# Altium project MSXIV_DC-DC_Converter.PrjPcb
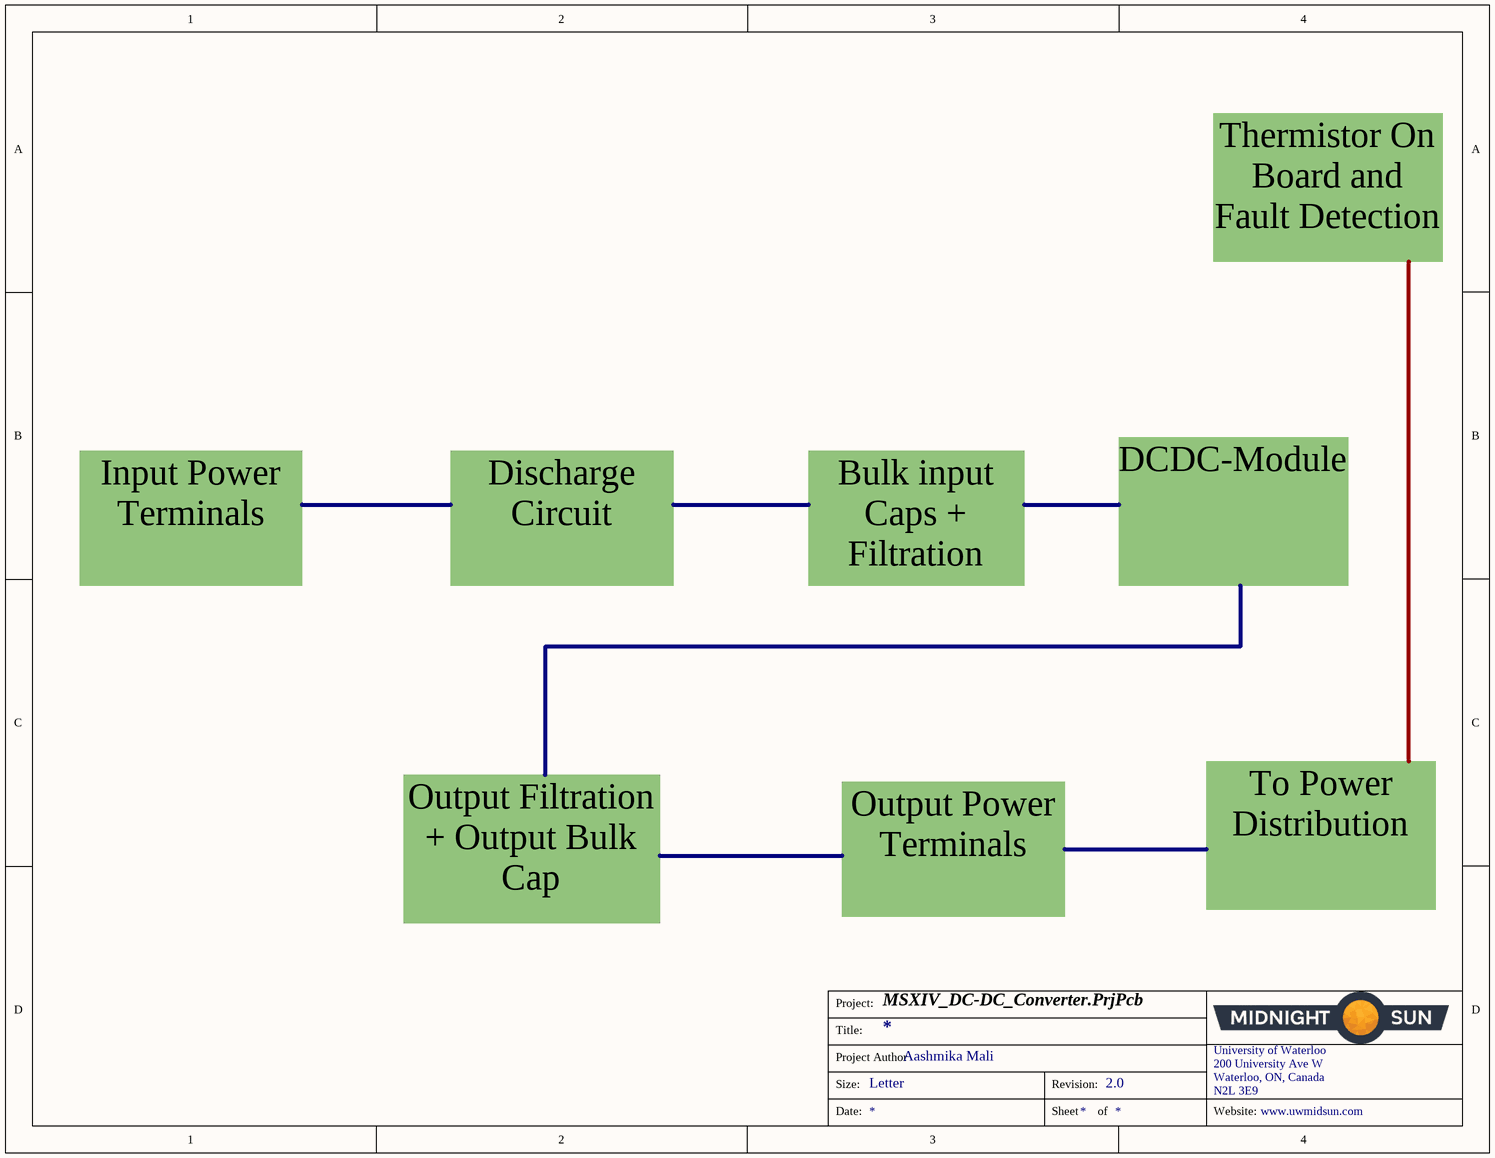
[diagram p0: Block_Diagram.SchDoc]
ProjectAuthor: Aashmika Mali; ProjectRevision: 2.0
3 sheets, 69 parts. Net scope: flat (ports and power ports of the same name join across sheets).
Board file: MSXIV_DC-DC_Converter.PcbDoc
Sheets:
  Block_Diagram.SchDoc
  MSXIV_DC-DC_Converter.SchDoc
  MSXIV_Discharge_Circuit.SchDoc

## Sheet Block_Diagram.SchDoc
size Letter; Website: www.uwmidsun.com

### Notes on the sheet
- Thermistor On Board and Fault Detection
- Input Power Terminals
- Discharge Circuit
- Bulk input Caps + Filtration
- DCDC-Module
- Output Power Terminals
- To Power Distribution
- Output Filtration + Output Bulk Cap
- Project:
- Title:
- Size:
- Project Author
- Letter
- Revision:
- University of Waterloo
- 200 University Ave W
- Waterloo, ON, Canada
- N2L 3E9
- Date:
- Sheet
- of
- Website:

## Sheet MSXIV_DC-DC_Converter.SchDoc
size B
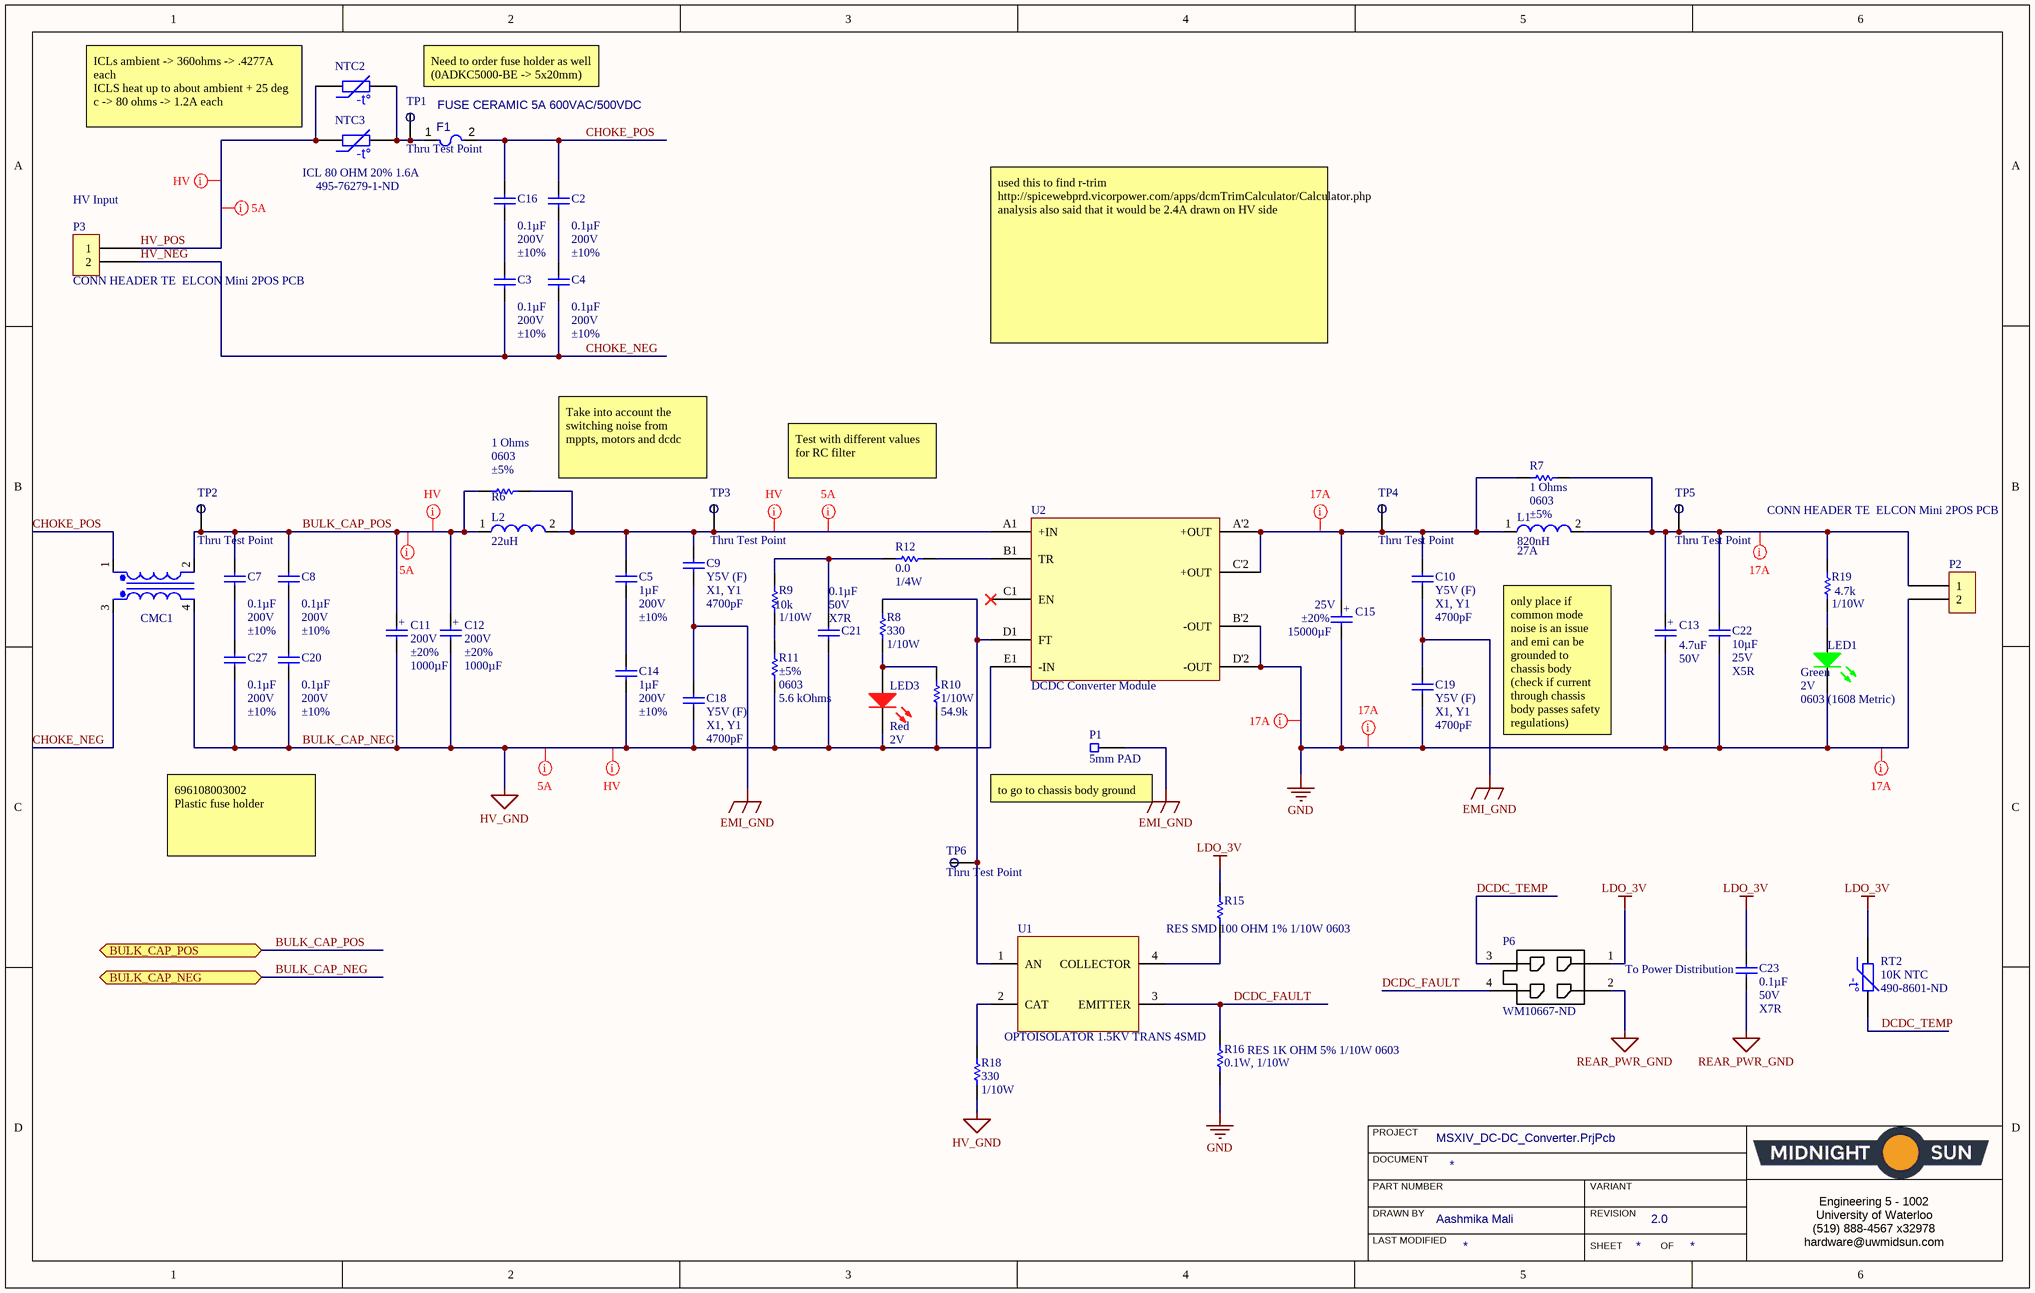
[diagram p1: MSXIV_DC-DC_Converter.SchDoc]

### Parts
C2  Capacitance: 0.1µF  Voltage - Rated: 200V  Tolerance: ±10%  [CAP, 1206]  (hidden comment: CAP CER 0.1UF 200V X7R 1206)
C3  Capacitance: 0.1µF  Voltage - Rated: 200V  Tolerance: ±10%  [CAP, 1206]  (hidden comment: CAP CER 0.1UF 200V X7R 1206)
C4  Capacitance: 0.1µF  Voltage - Rated: 200V  Tolerance: ±10%  [CAP, 1206]  (hidden comment: CAP CER 0.1UF 200V X7R 1206)
C5  Capacitance: 1µF  Voltage - Rated: 200V  Tolerance: ±10%  [CAP, 2220]  (hidden comment: CAP CER 1UF 200V X7R 2220)
C7  Capacitance: 0.1µF  Voltage - Rated: 200V  Tolerance: ±10%  [CAP, 1206]  (hidden comment: CAP CER 0.1UF 200V X7R 1206)
C8  Capacitance: 0.1µF  Voltage - Rated: 200V  Tolerance: ±10%  [CAP, 1206]  (hidden comment: CAP CER 0.1UF 200V X7R 1206)
C9  value 4700pF  Temperature Coefficient: Y5V (F)  Ratings: X1, Y1  [CAP 4700PF 400VAC Y5V RADIAL]  (hidden comment: CAP CER 4700PF 400VAC Y5V RADIAL)
C10  value 4700pF  Temperature Coefficient: Y5V (F)  Ratings: X1, Y1  [CAP 4700PF 400VAC Y5V RADIAL]  (hidden comment: CAP CER 4700PF 400VAC Y5V RADIAL)
C11  Voltage - Rated: 200V  Tolerance: ±20%  Capacitance: 1000µF  [CAP ALUM 1000uF 200V]  (hidden comment: CAP ALUM 1000UF 20% 200V SNAP)
C12  Voltage - Rated: 200V  Tolerance: ±20%  Capacitance: 1000µF  [CAP ALUM 1000uF 200V]  (hidden comment: CAP ALUM 1000UF 20% 200V SNAP)
C13  Capacitance: 4.7uF  Voltage Rating (DC): 50V  [CAP ALUM 6.3MM RADIAL SMD]  (hidden comment: EEE-1HA4R7NP)
C14  Capacitance: 1µF  Voltage - Rated: 200V  Tolerance: ±10%  [CAP, 2220]  (hidden comment: CAP CER 1UF 200V X7R 2220)
C15  Voltage - Rated: 25V  Tolerance: ±20%  Capacitance: 15000µF  [CAP ALUM 1000uF 200V]  (hidden comment: CAP ALUM 15000UF 20% 25V SNAP)
C16  Capacitance: 0.1µF  Voltage - Rated: 200V  Tolerance: ±10%  [CAP, 1206]  (hidden comment: CAP CER 0.1UF 200V X7R 1206)
C18  value 4700pF  Temperature Coefficient: Y5V (F)  Ratings: X1, Y1  [CAP 4700PF 400VAC Y5V RADIAL]  (hidden comment: CAP CER 4700PF 400VAC Y5V RADIAL)
C19  value 4700pF  Temperature Coefficient: Y5V (F)  Ratings: X1, Y1  [CAP 4700PF 400VAC Y5V RADIAL]  (hidden comment: CAP CER 4700PF 400VAC Y5V RADIAL)
C20  Capacitance: 0.1µF  Voltage - Rated: 200V  Tolerance: ±10%  [CAP, 1206]  (hidden comment: CAP CER 0.1UF 200V X7R 1206)
C21  Capacitance: 0.1µF  Voltage: 50V  Temperature Coefficient: X7R  [CAP, 0603]  (hidden comment: CAP CER 0.1UF 50V 10% X7R 0603)
C22  Capacitance: 10µF  Voltage: 25V  Temperature Coefficient: X5R  [CAP, 0603]  (hidden comment: CAP CER 10uF 25V 20% X5R 0603)
C23  Capacitance: 0.1µF  Voltage: 50V  Temperature Coefficient: X7R  [CAP, 0603]  (hidden comment: CAP CER 0.1UF 50V 10% X7R 0603)
C27  Capacitance: 0.1µF  Voltage - Rated: 200V  Tolerance: ±10%  [CAP, 1206]  (hidden comment: CAP CER 0.1UF 200V X7R 1206)
CMC1  CM Choke  [LCCI 50 Common mode choke]  (value not drawn)
F1  FUSE CERAMIC 5A 600VAC/500VDC  [0ADKC5000-BE-Footprint-1]
L1  Inductance: 820nH  Current Rating: 27A  [WE-HCI-1365]  (hidden comment: FIXED IND 820NH 27A 0.9 MOHM SMD)
L2  Inductance: 22uH  [WE-PD-XXL]  (hidden comment: FIXED IND 22UH 5.3A 28 MOHM SMD)
LED1  Package / Case: 0603 (1608 Metric)  Color: Green  Voltage - Forward (Vf) (Typ): 2V  [LED_0603]  (hidden comment: LED GREEN CLEAR 2V 0603)
LED3  Color: Red  Voltage - Forward (Vf) (Typ): 2V  [LED_0603]  (hidden comment: LED RED CLEAR 2V 0603)
NTC2  ICL 80 OHM 20% 1.6A  [ICL_THROUGH_HOLE_B57236S0800M051]  (value not drawn)
NTC3  ICL 80 OHM 20% 1.6A  Supplier Part Number 1: 495-76279-1-ND  [ICL_THROUGH_HOLE_B57236S0800M051]
P1  5mm PAD  [5mm PAD]
P2  CONN HEADER TE  ELCON Mini 2POS PCB  [CONN HEADER TE  ELCON Mini 2POS PCB-Footprint-1]
P3  CONN HEADER TE  ELCON Mini 2POS PCB  [CONN HEADER TE  ELCON Mini 2POS PCB-Footprint-1]
P6  Supplier Part Number 1: WM10667-ND  [CONN 4POS MICROFIT (2x2)]  (hidden comment: CONN 4POS MICRO-FIT 3mm)
R6  Resistance: 1 Ohms  Supplier Device Package: 0603  Tolerance: ±5%  [RES, 0603]  (hidden comment: RES 1 OHM 5% 1/10W 0603)
R7  Resistance: 1 Ohms  Supplier Device Package: 0603  Tolerance: ±5%  [RES, 0603]  (hidden comment: RES 1 OHM 5% 1/10W 0603)
R8  Resistance: 330  Power: 1/10W  [RES, 0603]  (hidden comment: RES 330 OHM 1% 1/10W 0603)
R9  Resistance: 10k  Power: 1/10W  [RES, 0603]  (hidden comment: RES 10K OHM 1% 1/10W 0603)
R10  Power (Watts): 1/10W  Resistance (Ohms): 54.9k  [RES, 0603]  (hidden comment: RES 54.9K OHM 1% 1/10W 0603)
R11  Tolerance: ±5%  Supplier Device Package: 0603  Resistance: 5.6 kOhms  [RES, 0603]  (hidden comment: RES 15.6K OHM 0.1% 1/10W 0402)
R12  Resistance: 0.0  Power (Watts): 1/4W  [RES, 0603]  (hidden comment: RES 0.0 OHM 1/4W 0603)
R15  RES SMD 100 OHM 1% 1/10W 0603  [RESC1608X55X25NL10T15]
R16  RES 1K OHM 5% 1/10W 0603  Power (Watts): 0.1W, 1/10W  [RES, 0603]
R18  Resistance: 330  Power: 1/10W  [RES, 0603]  (hidden comment: RES 330 OHM 1% 1/10W 0603)
R19  Resistance (Ohms): 4.7k  Power (Watts): 1/10W  [RES, 0603]  (hidden comment: RES 4.7K OHM 1% 1/10W 0603)
RT2  10K NTC  Supplier Part Number 1: 490-8601-ND  [NTC THERMISTOR BEAD]
TP1  Thru Test Point  [Thru Test Point]
TP2  Thru Test Point  [Thru Test Point]
TP3  Thru Test Point  [Thru Test Point]
TP4  Thru Test Point  [Thru Test Point]
TP5  Thru Test Point  [Thru Test Point]
TP6  Thru Test Point  [Thru Test Point]
U1  OPTOISOLATOR 1.5KV TRANS 4SMD  [SOIC127P610X228-4N]
U2  Type: DCDC Converter Module  [IC, DCDC converter DCM3623TA5N17B4T70]  (hidden comment: DCDC VICOR CONVERTER 15V 240W - DCM3623TA5N17B4T70)

### Ports
BULK_CAP_NEG (bidir), BULK_CAP_POS (bidir)

### Nets
BULK_CAP_NEG: C11.2 C12.2 C14.2 C18.2 C20.2 C21.2 C27.2 CMC1.4 LED3.2(K) R10.2 R11.1 R18.2 U2.E1(-IN) ; port BULK_CAP_NEG  [also labelled HV_GND]
EMI_GND: C9.2 C10.2 C18.1 C19.1 P1.1
GND: C13.2 C15.2 C19.2 C22.2 LED1.2(K) P2.2 R16.2 U2.B'2(-OUT) U2.D'2(-OUT)
LDO_3V: C23.1 P6.1 R15.2 RT2.1
REAR_PWR_GND: C23.2 P6.2
BULK_CAP_POS: C7.1 C8.1 C11.1 C12.1 CMC1.2 L2.1 R6.1 TP2.TH_TP ; port BULK_CAP_POS
CHOKE_NEG: C3.2 C4.2 CMC1.3 P3.2  [also labelled HV_NEG]
CHOKE_POS: C2.1 C16.1 CMC1.1 F1.2
DCDC_FAULT: P6.4 R16.1 U1.3(EMITTER)
DCDC_TEMP: P6.3 RT2.2
HV_POS: NTC2.1 NTC3.1 P3.1
NetC2_2: C2.2 C4.1
NetC3_1: C3.1 C16.2
NetC5_1: C5.1 C9.1 L2.2 R6.2 TP3.TH_TP U2.A1(+IN)
NetC5_2: C5.2 C14.1
NetC7_2: C7.2 C27.1
NetC8_2: C8.2 C20.1
NetC10_1: C10.1 C15.1 L1.1 R7.1 TP4.TH_TP U2.A'2(+OUT) U2.C'2(+OUT)
NetC13_1: C13.1 C22.1 L1.2 P2.1 R7.2 R19.1 TP5.TH_TP
NetC21_1: C21.1 R9.1 R12.1
NetF1_1: F1.1 NTC2.2 NTC3.2 TP1.TH_TP
NetLED1_1: LED1.1(A) R19.2
NetLED3_1: LED3.1(A) R8.2 R10.1
NetR8_1: R8.1 TP6.TH_TP U1.1(AN) U2.D1(FT)
NetR9_2: R9.2 R11.2
NetR12_2: R12.2 U2.B1(TR)
NetR15_1: R15.1 U1.4(COLLECTOR)
NetR18_1: R18.1 U1.2(CAT)

Not connected (* = marked no-connect by the designer): U2 C1(EN)*

### Layout directives
net class HV: BULK_CAP_NEG, BULK_CAP_POS, HV_POS, NetC5_1
net class 5A: BULK_CAP_NEG, BULK_CAP_POS, HV_POS, NetC5_1
net class 20A: GND, NetC10_1, NetC13_1

### Notes on the sheet
- (near TP1) Need to order fuse holder as well
  (0ADKC5000-BE -> 5x20mm)
- ICLs ambient -> 360ohms -> .4277A each
  ICLS heat up to about ambient + 25 deg c -> 80 ohms -> 1.2A each
- (near P3) HV Input
- used this to find r-trim http://spicewebprd.vicorpower.com/apps/dcmTrimCalculator/Calculator.php
  analysis also said that it would be 2.4A drawn on HV side
- Take into account the switching noise from mppts, motors and dcdc
- Test with different values for RC filter
- only place if common mode noise is an issue and emi can be grounded to chassis body (check if current through chassis body passes safety regulations)
- (near P1) to go to chassis body ground
- 696108003002
  Plastic fuse holder
- (near C23) To Power Distribution
- PROJECT
- DOCUMENT
- DRAWN BY
- LAST MODIFIED
- PART NUMBER
- REVISION
- SHEET
- VARIANT
- OF
- Engineering 5 - 1002
  University of Waterloo
  (519) 888-4567 x32978
  hardware@uwmidsun.com
- (in symbol CAP ALUM 4.7UF 20% 50V SMD) +
- (in symbol CAP ALUM 1000UF 20% 200V SNAP) +
- (in symbol CAP ALUM 15000UF 20% 25V SNAP) +
- (in symbol ICL 80 OHM 20% 1.6A) -t°
- (in symbol NTC THERMISTOR 10K 1% BEAD) -t°

### Library data of the parts
C2-C4 C7 C8 C16 C20 C27 = CAP CER 0.1UF 200V X7R 1206: Manufacturer 1: Manufacturer; Manufacturer Part Number 1: 885342208002; Supplier 1: Digi-Key; Supplier Part Number 1: 732-12081-1-ND; Temperature Coefficient: X7R; Package / Case: 1206 (3216 Metric)
C5 C14 = CAP CER 1UF 200V X7R 2220: 1µF ±10% 200V Ceramic Capacitor X7R 2220 (5750 Metric); Manufacturer: Murata Electronics; Manufacturer Part Number 1: GRM55DR72D105KW01L; Mounting Type 1: Surface Mount, MLCC; Supplier 1: Digi-Key; Supplier Part Number 1: 490-14683-1-ND; Temperature Coefficient: X7R; Package / Case: 2220 (5750 Metric); Size / Dimension: 0.224" L x 0.197" W (5.70mm x 5.00mm)
C9 C10 C18 C19 = CAP CER 4700PF 400VAC Y5V RADIAL: 4700pF ±20% 400VAC Ceramic Capacitor Y5V (F) Radial, Disc; Manufacturer: KEMET; Manufacturer Part Number: C951U472MVVDBA7317; Supplier 1: Digi-Key; RoHS: RoHS Compliant; Category: Capacitors; Stock 1: 9713; Pricing 1: 1=1.12, 10=0.795, 100=0.5234, 500=0.38772 (CAD); Packaging: Cut Tape (CT); Part Status: Active; Tolerance: ±20%; Voltage - Rated: 400VAC; Operating Temperature: -40°C ~ 125°C; Features: -; Applications: Safety; Failure Rate: -; Mounting Type: Through Hole; Package / Case: Radial, Disc; Size / Dimension: 0.472" Dia (12.00mm); Height - Seated (Max): -; Thickness (Max): -; Lead Spacing: 0.394" (10.00mm); Lead Style: Formed Leads - Kinked; ComponentLink1URL: https://search.kemet.com/component-edge/download/datasheet/C951U472MVVDBA7317.pdf; ComponentLink1Description: https://search.kemet.com/component-edge/download/datasheet/C951U472MVVDBA7317.pdf; Supplier Part Number 1: 399-9517-1-ND
C11 C12 = CAP ALUM 1000UF 20% 200V SNAP: CAP RADIAL ALUM 1000UF 20% 200V SNAP; Manufacturer 1: Cornell Dubilier Electronics (CDE); Manufacturer Part Number 1: SLPX102M200C4P3; ESR (Equivalent Series Resistance): 199mOhm @ 120Hz; Polarization: Polar; Supplier 1: Digi-Key; Supplier Part Number 1: 338-1557-ND; Mounting Type: Through Hole; Package / Case: Radial, Can - Snap-In
C13 = CAP ALUM 4.7UF 20% 50V SMD: 4.7µF 50V Aluminum Electrolytic Capacitors Radial, Can - SMD 2000 Hrs @ 85°C; Manufacturer 1: Panasonic; Description 1: CAPACITOR ALUM ELEC, 4.7UF, 50V, 20%, SMD; Ripple Current: 31mA; Tolerance: 20%; Life (Hours): 2000Hour; Supplier 1: Digi-Key; Supplier Part Number 1: PCE4304CT-ND; Manufacturer Part Number 1: EEE-1HA4R7NP; Stock 1: 19771; Pricing 1: 1=0.43, 10=0.302, 100=0.1986, 500=0.1471 (USD); Mount: Surface Mount,PCB; Case/Package: Radial; Min Operating Temperature: -40°C; Max Operating Temperature: 85°C; Voltage Rating: 50V; Ripple Current (AC): 31mA; Packaging: Tape and Reel; Package Quantity: 1; Termination: SMD/SMT; Diameter: 6.3mm; Length: 5.5mm; Height: 5.4mm; Height - Seated (Max): 0.213inch; Width: 650um; Radiation Hardening: No; REACH SVHC: No SVHC; Lead Free: Lead Free; ComponentLink1URL: https://datasheet.ciiva.com/46374/aba0000ce2-46374373.pdf; ComponentLink1Description: https://datasheet.ciiva.com/46374/aba0000ce2-46374373.pdf; ComponentLink2URL: https://datasheet.ciiva.com/14600/70255710-14600343.pdf; ComponentLink2Description: https://datasheet.ciiva.com/14600/70255710-14600343.pdf; ComponentLink3URL: https://datasheet.ciiva.com/17536/aba0000ce2-17536647.pdf; ComponentLink3Description: https://datasheet.ciiva.com/17536/aba0000ce2-17536647.pdf; ComponentLink4URL: https://datasheet.ciiva.com/24027/aba0000ce2-40801-24027083.pdf; ComponentLink4Description: https://datasheet.ciiva.com/24027/aba0000ce2-40801-24027083.pdf; ComponentLink5URL: https://datasheet.ciiva.com/31414/aba0000ce2-31414684.pdf; ComponentLink5Description: https://datasheet.ciiva.com/31414/aba0000ce2-31414684.pdf; ComponentLink6URL: https://datasheet.ciiva.com/14606/70255710-14606079.pdf; ComponentLink6Description: https://datasheet.ciiva.com/14606/70255710-14606079.pdf
C15 = CAP ALUM 15000UF 20% 25V SNAP: 15000µF 25V Aluminum Electrolytic Capacitors Radial, Can - Snap-In 40mOhm 3000 Hrs @ 105°C; Manufacturer: Cornell Dubilier Electronics (CDE); Manufacturer Part Number: SLP153M025C4P3; Parameter 1: 0.984" Dia (25.00mm); Supplier 1: Digi-Key; Supplier Part Number 1: 338-1470-ND; Size / Dimension: 0.984" Dia (25.00mm)
C21 C23 = CAP CER 0.1UF 50V 10% X7R 0603: 0.10µF ±10% 50V Ceramic Capacitor X7R 0603 (1608 Metric); Manufacturer 1: AVX Corporation; Manufacturer Part Number 1: 06035C104KAT2A; Supplier 1: Digi-Key; Supplier Part Number 1: 478-5052-1-ND; Packaging: Cut Tape (CT); Part Status: Active; Operating Temperature: -55°C ~ 125°C; Ratings: -; Mounting Type: Surface Mount, MLCC; Package / Case: 0603 (1608 Metric); Size / Dimension: 0.063" L x 0.032" W (1.60mm x 0.81mm); Height - Seated (Max): -; Thickness (Max): 0.035" (0.90mm); Lead Spacing: -; Lead Style: -; ComponentLink1URL: http://datasheets.avx.com/X7RDielectric.pdf; ComponentLink1Description: http://datasheets.avx.com/X7RDielectric.pdf; Tolerance: ±10%
C22 = CAP CER 10uF 25V 20% X5R 0603: 10µF ±20% 25V Ceramic Capacitor X5R 0603 (1608 Metric); Manufacturer 1: Murata Electronics North America; Manufacturer Part Number 1: GRM188R61E106MA73D; Supplier 1: Digi-Key; Supplier Part Number 1: 490-7202-1-ND; Packaging: Cut Tape (CT); Part Status: Active; Operating Temperature: -55°C ~ 85°C; Ratings: -; Mounting Type: Surface Mount, MLCC; Package / Case: 0603 (1608 Metric); Size / Dimension: 0.063" L x 0.031" W (1.60mm x 0.80mm); Height - Seated (Max): -; Thickness (Max): 0.031" (0.80mm); Lead Spacing: -; Lead Style: -; ComponentLink1URL: http://www.murata.com/~/media/webrenewal/support/library/catalog/products/capacitor/mlcc/c02e.ashx; ComponentLink1Description: http://www.murata.com/~/media/webrenewal/support/library/catalog/products/capacitor/mlcc/c02e.ashx; Tolerance: ±20%
CMC1 = COMMON MODE CHOKE 5.6A 2LN SMD: 2 Line Common Mode Choke Surface Mount  5.6A DCR 21mOhm; PartNumber: P0353NL; Manufacturer 1: Pulse Electronics Power; Manufacturer Part Number 1: P0353NLT; Filter Type: Power Line; Number of Lines: 2; Package: TBD; Supplier 1: Digi-Key; Supplier Part Number 1: 553-1764-1-ND; Current Rating (Max): 5.6A; DC Resistance (DCR) (Max): 21mOhm
F1 = CMP-005-00013-1: FUSE CERAMIC 5A 600VAC/500VDC FOOTPRINT IS FOR 5x20mm HOLDER; Fuse Type: Cartridge, Ceramic; Approvals: cURus; Voltage Rating (DC): 500V; Voltage Rating (AC): 600V; Mount: Holder; Current Rating: 5A; Min Operating Temperature: -55°C; Max Operating Temperature: 125°C; Packaging: Bulk
L1 = CMP-006-00021-1: WURTH ELEKTRONIK         744355182             Surface Mount Power Inductor, WE-HCI Series, 820 nH, 27 A, 35 A, Shielded, 9000 ohm; Test Frequency: 100kHz; Saturation Current: 35A; DC Resistance (DCR): 0.9mR; Inductance Tolerance: 20%; Self Resonant Frequency: 72MHz; Series Resistance: 900mR; Packaging: Tape and Reel; Min Operating Temperature: -40°C; Length: 13.2mm; Composition: Wirewound; RMS Current (Irms): 27A; Width: 12.8mm; Shielding: Shielded; Military Standard: Not; Case/Package: 1365; Termination: SMD/SMT; Max Operating Temperature: 155°C; Number of Pins: 2; REACH SVHC: Unknown; Tolerance: 20%; Height - Seated (Max): 0.197inch; Depth: 13.3mm; Height: 6.2mm; Max DC Current: 27A; Mount: Surface Mount; Package Quantity: 400
L2 = CMP-006-00023-1: Inductor, SMD 22 uH 5.3 A ±20%, 7447709220, Würth Elektronik; Test Frequency: 1kHz; Self Resonant Frequency: 10MHz; Series Resistance: 28mR; Saturation Current: 6.5A; Shielding: Shielded; Core Material: Ferrite; Inductance Tolerance: 20%; Case/Package: Nonstandard; Height: 10mm; DC Current: 5.3A; Military Standard: Not; Number of Pins: 2; Length: 12mm; Composition: Wirewound; Height - Seated (Max): 0.394inch; Case Code (Metric): 3225; Depth: 12.5mm; RMS Current (Irms): 5.3A; REACH SVHC: Unknown; Max Operating Temperature: 125°C; Resistance: 28mR; Termination: SMD/SMT; Weight: 0.01lb; Case Code (Imperial): 1210; Current Rating: 5.3A; Max DC Current: 5.3A; Mount: Surface Mount; Width: 12mm; Package Quantity: 250; DC Resistance (DCR): 28mR; Lead Pitch: 7mm; Min Operating Temperature: -40°C; Tolerance: 20%; Packaging: Tape and Reel
LED1 = LED GREEN CLEAR 2V 0603: Green 572nm LED Indication - Discrete 2V 0603 (1608 Metric); Manufacturer: Wurth Electronics Inc.; Manufacturer Part Number: 150060VS75000; Lens Color: Colorless; Millicandela Rating: 40mcd; Lens Style/Size: Rectangle with Flat Top, 1.10mm x 0.70mm; Current - Test: 20mA; Viewing Angle: 140°; Wavelength - Dominant: 570nm; Supplier 1: Digi-Key; RoHS: RoHS Compliant; Category: Optoelectronics; Stock 1: 9408; Pricing 1: 1=0.21, 100=0.1617, 500=0.13964 (CAD); Packaging: Cut Tape (CT); Part Status: Active; Lens Transparency: Clear; Mounting Type: Surface Mount; Wavelength - Peak: 572nm; Features: -; Supplier Device Package: 0603; Size / Dimension: 1.60mm L x 0.80mm W; Height (Max): 0.80mm; ComponentLink1URL: http://katalog.we-online.de/led/datasheet/150060VS75000.pdf; ComponentLink1Description: http://katalog.we-online.de/led/datasheet/150060VS75000.pdf; Supplier Part Number 1: 732-4980-1-ND
LED3 = CMP-011-0004-1: Red 631nm LED Indication - Discrete 2V 0603 (1608 Metric); Manufacturer: Wurth Electronics Inc.; Manufacturer Part Number: 150060RS75000; Lens Style/Size: Rectangle with Flat Top, 1.10mm x 0.70mm; Current - Test: 20mA; Wavelength - Dominant: 625nm; Millicandela Rating: 250mcd; Wavelength - Peak: 630nm; Lens Color: Colorless; Viewing Angle: 140°; Size / Dimension: 1.60mm L x 0.80mm W; Pricing 1: 1=0.21, 100=0.1617, 500=0.13964 (CAD); ComponentLink1URL: http://katalog.we-online.de/led/datasheet/150060RS75000.pdf; Mounting Type: Surface Mount; Height (Max): 0.80mm; Design Item ID: LED RED CLEAR 2V 0603; Part Status: Active; Stock 1: 35521; ComponentLink1Description: http://katalog.we-online.de/led/datasheet/150060RS75000.pdf; Source: Schematic Diagrams.SchLib; RoHS: RoHS Compliant; Features: -; Packaging: Cut Tape (CT); Lens Transparency: Clear; Supplier Device Package: 0603; Case/Package: 0603 (1608 Metric)
NTC2 NTC3 = ICL 80 OHM 20% 1.6A: Thermistor NTC 80 Ohm 20% 2-Pin Radial 3300K Cardboard T/R; Manufacturer: TDK EPCOS; Manufacturer Part Number: B57236S0800M051; Supplier 1: Digi-Key; RoHS: Yes; Category: Interface ICs; Stock 1: 4719; Pricing 1: 1=1.35000, 5=1.29800, 10=1.05500, 25=0.90880, 50=0.78720, 100=0.71410, 500=0.60052 (USD); Mount: Through Hole; Case/Package: Radial; Number of Pins: 2; Contact Plating: Tin; Min Operating Temperature: -55°C; Max Operating Temperature: 170°C; Packaging: Tape and Reel; Tolerance: 20%; Diameter: 11.5mm; Depth: 6mm; Radiation Hardening: No; ComponentLink1URL: https://datasheet.ciiva.com/26807/getdatasheetpartid-133603-26807898.pdf?src-supplier=Verical; ComponentLink1Description: https://datasheet.ciiva.com/26807/getdatasheetpartid-133603-26807898.pdf?src-supplier=Verical
  NTC2: Supplier Part Number 1: 495-76279-1-ND
P1 = 5mm PAD: 5x5mm pad to solder 16 gauge wire
P2 P3 = CMP-002-00071-2: CONN HEADER 2POS PCB; Contact Current Rating: 40A; Number of Contacts: 2; Pitch: 7.8mm; Contact Retention: Yes (With); Sealable: No (Without); Current Rating: 45A; Circuit Application: Power; Gender: Male; Connector Type: Pin; PCB Mounting Orientation: Vertical; Number of Ports: 1; Connector System: Wire-to-Board; Number of Rows: 1; Contact Plating: Silver; Housing Color: Black; Length: 18.9mm; Package Quantity: 150; Number of Terminals: 4; Orientation: Straight; REACH SVHC: Unknown; Contact Material: Copper Alloy,Copper; Housing Material: Polymer; Depth: 10.2mm; Row Spacing: 7.8mm; Termination: Through Hole; Min Operating Temperature: -40°C; Number of Positions: 2; Contact Gender: Male; Packaging: Tape and Reel; Mount: Through Hole; Number of Power Positions: 2; Radiation Hardening: No; Flammability Rating: UL94 V-0; Max Operating Temperature: 125°C
P6 = CONN 4POS MICRO-FIT 3mm: Micro-Fit 3.0 Vertical Header, 3.00mm Pitch, Dual Row, 4 Circuits, with PCB Polarizing Peg, Tin, Glow-Wire Capable, Black; Manufacturer: Molex, LLC; Manufacturer Part Number: 0430450827; Pitch - Mating: 0.118" (3.00mm); Number of Positions: 6; Number of Positions Loaded: All; Style: Board to Cable/Wire; Shrouding: Shrouded - 4 Wall; Contact Length - Post: 0.125" (3.18mm); Material Flammability Rating: UL94 V-0; Contact Resistance: 10mR; Number of Contacts: 4; Number of Ports: 1; Row Spacing: 0.118inch; RoHS: RoHS Compliant; Category: Connectors, Interconnects; Packaging: Tray; Part Status: Active; Connector Type: Header; Contact Type: Male Pin; Number of Rows: 2; Row Spacing - Mating: 0.118" (3.00mm); Mounting Type: Through Hole; Termination: Solder; Fastening Type: Locking Ramp; Contact Length - Mating: -; Overall Contact Length: -; Insulation Height: 0.390" (9.91mm); Contact Shape: Square; Contact Finish - Mating: Tin; Contact Finish Thickness - Mating: 60.0µin (1.52µm); Contact Finish - Post: Tin; Contact Material: Brass; Insulation Material: Liquid Crystal Polymer (LCP), Glass Filled; Features: Board Guide; Operating Temperature: -; Ingress Protection: -; Insulation Color: Black; Current Rating: -; Voltage Rating: -; Mated Stacking Heights: -; Contact Finish Thickness - Post: -; Applications: General Purpose, Medical, Military, Telecommunications; ComponentLink1URL: https://www.molex.com/pdm_docs/sd/430450627_sd.pdf; ComponentLink1Description: https://www.molex.com/pdm_docs/sd/430450627_sd.pdf; ComponentLink2URL: https://www.molex.com/pdm_docs/sd/430450827_sd.pdf; ComponentLink2Description: https://www.molex.com/pdm_docs/sd/430450827_sd.pdf; Mount: Through Hole; Contact Plating: Tin; Housing Material: Polymer; Color: Black; Number of Terminals: 4; Housing Color: Black; Min Operating Temperature: -40°C; Max Operating Temperature: 105°C; Package Quantity: 2232; Orientation: Straight; Length: 10.15mm; Pitch: 3mm; Depth: 8.77mm; ComponentLink3URL: http://www.molex.com/pdm_docs/sd/430450427_sd.pdf; ComponentLink3Description: http://www.molex.com/pdm_docs/sd/430450427_sd.pdf; ComponentLink4URL: http://www.molex.com/webdocs/datasheets/pdf/en-us/0430450427_PCB_HEADERS.pdf; ComponentLink4Description: http://www.molex.com/webdocs/datasheets/pdf/en-us/0430450427_PCB_HEADERS.pdf; Supplier 1: Digi-Key
R6 R7 = RES 1 OHM 5% 1/10W 0603: RES SMD 1 OHM 5% 1/10W 0603; Manufacturer 1: Rohm Semiconductor; Manufacturer Part Number 1: KTR03EZPJ1R0; Detailed Description: 1 Ohms ±5% 0.1W, 1/10W Chip Resistor 0603 (1608 Metric) Automotive AEC-Q200, High Voltage Thick Film; Power (Watts): 0.1W, 1/10W; Digi-Key Part Number: RHM1.0AZCT-ND; Package / Case: 0603 (1608 Metric); Supplier 1: Digi-Key; Supplier Part Number 1: RHM1.0AZCT-ND
R8 R18 = RES 330 OHM 1% 1/10W 0603: 330 Ohms ±1% 0.1W, 1/10W Chip Resistor 0603 (1608 Metric) Automotive AEC-Q200, Moisture Resistant Thick Film; Manufacturer: TE Connectivity; Manufacturer Part Number: 1-2176339-9; Supplier 1: Digi-Key; Stock 1: 0; Supplier Part Number 1: A129682TR-ND
R9 = RES 10K OHM 1% 1/10W 0603: RES SMD 10K OHM 1% 1/10W 0603; Manufacturer 1: Yageo; Manufacturer Part Number 1: RC0603FR-0710KL; Temperature Coefficient: ±100ppm/°C; Supplier 1: Digi-Key; Supplier Part Number 1: 311-10.0KHRCT-ND; Packaging: Cut Tape (CT); Part Status: Active; Composition: Thick Film; Operating Temperature: -55°C ~ 155°C; Package / Case: 0603 (1608 Metric); Supplier Device Package: 0603; Size / Dimension: 0.063" L x 0.031" W (1.60mm x 0.80mm); Height - Seated (Max): 0.022" (0.55mm); Failure Rate: -; ComponentLink1URL: http://www.yageo.com/documents/recent/PYu-RC_Group_51_RoHS_L_7.pdf; ComponentLink1Description: http://www.yageo.com/documents/recent/PYu-RC_Group_51_RoHS_L_7.pdf; Tolerance: ±1%
R10 = RES 54.9K OHM 1% 1/10W 0603: 54.9k Ohm ±1% 0.1W, 1/10W Chip Resistor 0603 (1608 Metric) Automotive AEC-Q200 Thick Film; Manufacturer: Panasonic Electronic Components; Manufacturer Part Number: ERJ-3EKF5492V; Temperature Coefficient: ±100ppm/°C; Supplier 1: Digi-Key; RoHS: RoHS Compliant; Category: Resistors; Stock 1: 74038; Pricing 1: 1=0.16, 10=0.031, 100=0.0127, 1000=0.00567, 2500=0.00492 (CAD); Packaging: Cut Tape (CT); Part Status: Active; Composition: Thick Film; Features: Automotive AEC-Q200; Operating Temperature: -55°C ~ 155°C; Package / Case: 0603 (1608 Metric); Supplier Device Package: 0603; Size / Dimension: 0.063" L x 0.031" W (1.60mm x 0.80mm); Height - Seated (Max): 0.022" (0.55mm); Failure Rate: -; ComponentLink1URL: https://industrial.panasonic.com/cdbs/www-data/pdf/RDA0000/AOA0000C298.pdf; ComponentLink1Description: https://industrial.panasonic.com/cdbs/www-data/pdf/RDA0000/AOA0000C298.pdf; Supplier Part Number 1: P54.9KHCT-ND; Tolerance: ±1%
R11 = RES 5.6K OHM 5% 1/10W 0603: 5.6 kOhms ±5% 0.1W, 1/10W Chip Resistor 0603 (1608 Metric) Moisture Resistant Thick Film; Manufacturer Part Number 1: RC0603JR-075K6L; Manufacturer 1: Yageo; Supplier 1: Digi-Key; Supplier Part Number 1: 311-5.6KGRCT-ND
R12 = RES 0.0 OHM 1/4W 0603: RES SMD 0.0 OHM JUMPER 1/4W 0603; Manufacturer 1: Vishay Dale; Manufacturer Part Number 1: CRCW06030000Z0EAHP; Supplier 1: Digi-Key; Supplier Part Number 1: 541-0.0SBCT-ND; Packaging: Cut Tape (CT); Part Status: Active; Composition: Thick Film; Operating Temperature: -55°C ~ 155°C; Package / Case: 0603 (1608 Metric); Supplier Device Package: 0603; Size / Dimension: 0.063" L x 0.033" W (1.60mm x 0.85mm); Height - Seated (Max): 0.022" (0.55mm); Failure Rate: -; ComponentLink1URL: http://www.vishay.com/docs/20043/crcwhpe3.pdf; ComponentLink1Description: http://www.vishay.com/docs/20043/crcwhpe3.pdf
R15 = CMP-009-00178-1: YAGEO         RC0603FR-07100RL            RES, THICK FILM, 100R, 1%, 0.1W, 0603, REEL; Power Rating: 100mW; Voltage Rating (DC): 50V; Temperature Coefficient: 100ppm/°C; Lead Free: Lead Free; Height: 0.45mm; Case Code (Imperial): 0603; Length: 1.6mm; Case Code (Metric): 1608; Min Operating Temperature: -55°C; Composition: Thick Film; REACH SVHC: Unknown; Military Standard: Not; Width: 0.8mm; Resistance: 100R; Termination: SMD/SMT; Case/Package: 0603; Depth: 0.8mm; Tolerance: 1%; Packaging: Tape and Reel; Max Operating Temperature: 155°C; Number of Pins: 2; Voltage Rating: 50V
R16 = CMP-010-0006-1: 1k Ohm ±5% 0.1W, 1/10W Chip Resistor 0603 (1608 Metric); Manufacturer: Yageo; Manufacturer Part Number: RC0603JR-071KL; Temperature Coefficient: ±100ppm/°C; Height - Seated (Max): 0.022" (0.55mm); Part Status: Active; Size / Dimension: 0.063" L x 0.031" W (1.60mm x 0.80mm); ComponentLink1Description: http://www.yageo.com/documents/recent/PYu-RC_Group_51_RoHS_L_7.pdf; Pricing 1: 1=0.15, 10=0.017, 100=0.0071, 1000=0.0032, 2500=0.00278 (CAD); Packaging: Cut Tape (CT); RoHS: RoHS Compliant; Tolerance: 5%; Operating Temperature: -55°C ~ 155°C; Package / Case: 0603 (1608 Metric); Features: Moisture Resistant; Resistance (Ohms): 1k; ComponentLink1URL: http://www.yageo.com/documents/recent/PYu-RC_Group_51_RoHS_L_7.pdf; Failure Rate: -; Supplier Device Package: 0603; Stock 1: 4415240; Composition: Thick Film; Design Item ID: RES 1K OHM 5% 1/10W 0603; Source: Schematic Diagrams.SchLib
R19 = RES 4.7K OHM 1% 1/10W 0603: 4.7k Ohm ±1% 0.1W, 1/10W Chip Resistor 0603 (1608 Metric) Moisture Resistant Thick Film; Manufacturer 1: Yageo; Manufacturer Part Number 1: RC0603FR-074K7L; Description 1: RES SMD 4.7K OHM 1% 1/10W 0603; Temperature Coefficient: ±100ppm/°C; Supplier 1: Digi-Key; Supplier Part Number 1: 311-4.70KHRCT-ND; RoHS: RoHS Compliant; Category: Resistors; Stock 1: 3487566; Pricing 1: 1=0.16, 10=0.022, 100=0.0089, 1000=0.00402, 2500=0.00349 (CAD); Packaging: Cut Tape (CT); Part Status: Active; Composition: Thick Film; Features: Moisture Resistant; Operating Temperature: -55°C ~ 155°C; Package / Case: 0603 (1608 Metric); Supplier Device Package: 0603; Size / Dimension: 0.063" L x 0.031" W (1.60mm x 0.80mm); Height - Seated (Max): 0.022" (0.55mm); Failure Rate: -; ComponentLink1URL: http://www.yageo.com/documents/recent/PYu-RC_Group_51_RoHS_L_7.pdf; ComponentLink1Description: http://www.yageo.com/documents/recent/PYu-RC_Group_51_RoHS_L_7.pdf; Tolerance: ±1%
RT2 = NTC THERMISTOR 10K 1% BEAD: NTC Thermistor 10k Bead; Manufacturer: Murata Electronics North America; Manufacturer Part Number: NXRT15XH103FA1B030; Resistance Tolerance: ±1%; B25/50: 3380K; B25/85: 3434K; B25/100: 3455K; Supplier 1: Digi-Key; RoHS: RoHS Compliant; Category: Sensors, Transducers; Stock 1: 25017; Pricing 1: 1=0.96, 5=0.91, 10=0.792, 25=0.696, 50=0.5784, 100=0.4925, 500=0.42834, 1000=0.3748, 5000=0.33197 (CAD); Packaging: Bulk; Part Status: Active; Resistance in Ohms @ 25°C: 10k; B Value Tolerance: ±1%; B0/50: -; B25/75: -; Operating Temperature: -40°C ~ 125°C; Length - Lead Wire: -; Mounting Type: Through Hole; Package / Case: Bead; ComponentLink1URL: https://www.murata.com/~/media/webrenewal/support/library/catalog/products/thermistor/ntc/r44e.ashx; ComponentLink1Description: https://www.murata.com/~/media/webrenewal/support/library/catalog/products/thermistor/ntc/r44e.ashx
TP1-TP6 = CMP-003-0176-1: Design Item ID: Thru Test Point; Source: Schematic Diagrams.SchLib
U1 = CMP-015-00008-1: Transistor Output Optocouplers Dual 1 Form-A relay 4-Pin SOP; Number of Channels: 1; Collector Emitter Voltage (VCEO): 300mV; Package Quantity: 100; Lead Free: Lead Free; Case/Package: SOP; Number of Pins: 4; Max Operating Temperature: 85°C; Min Operating Temperature: -40°C; Mount: Surface Mount; Packaging: Rail/Tube
U2 = DCDC VICOR CONVERTER 15V 240W - DCM3623TA5N17B4T70: DC DC CONVERTER 15V 240W; Manufacturer 1: Vicor Corporation; Number of Outputs: 1; Voltage - Input (Min): 154V; Voltage - Input (Max): 43V; Current - Output (Max): 16A; Efficiency: 92.1%; Supplier 1: Digi-Key; Supplier Part Number 1: 1470-2950-1-ND; Manufacturer Part Number 1: DCM3623TA5N17B4T70; Packaging: Cut Tape (CT); Part Status: Active; Voltage - Output 1: 15V; Voltage - Output 2: -; Voltage - Output 3: -; Operating Temperature: -40°C ~ 105°C; Mounting Type: Surface Mount; Package / Case: 9-DIP Module; Size / Dimension: 1.52" L x 0.90" W x 0.28" H (38.72mm x 22.8mm x 7.2mm); ComponentLink1URL: http://www.vicorpower.com/documents/datasheets/DCM3623xA5N17B4y7z_ds.pdf; ComponentLink1Description: http://www.vicorpower.com/documents/datasheets/DCM3623xA5N17B4y7z_ds.pdf; Power: 240W

## Sheet MSXIV_Discharge_Circuit.SchDoc
size Letter; Website: www.uwmidsun.com
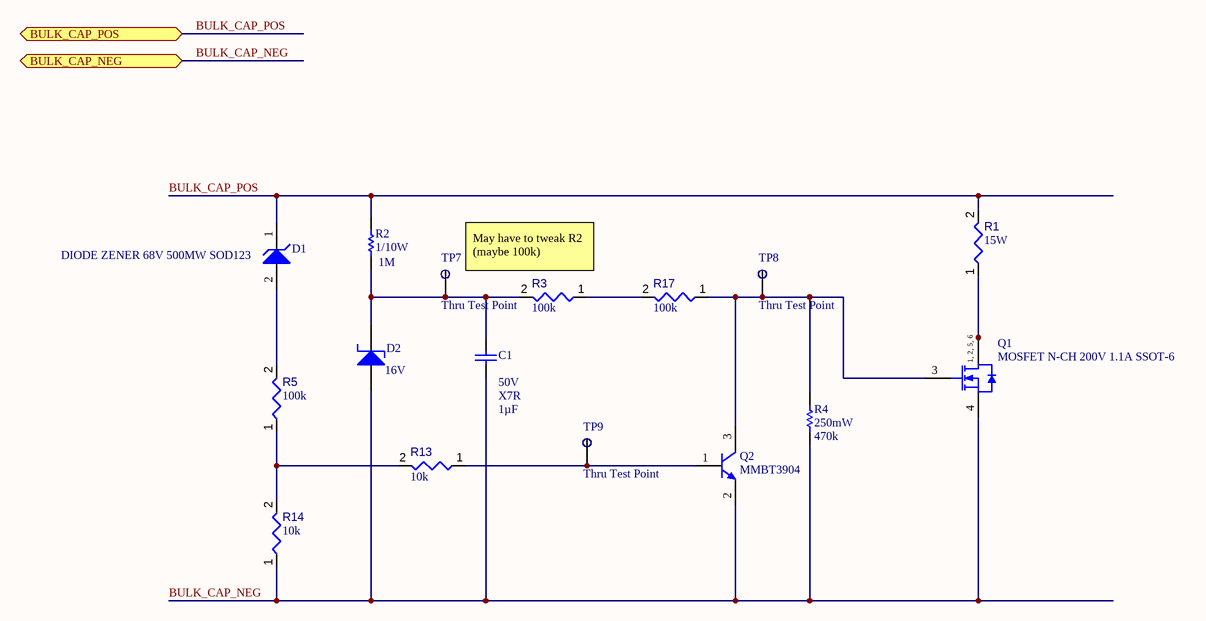
[diagram p2: MSXIV_Discharge_Circuit.SchDoc]

### Parts
C1  value 1µF  Voltage: 50V  Temperature Coefficient: X7R  [CAP, 0603]  (hidden comment: CAP CER 1UF 50V 10% X7R 0603)
D1  DIODE ZENER 68V 500MW SOD123  [ONSC-SOD-123-2-425-04_V]
D2  Voltage - Zener (Nom): 16V  [DO-214AA Diode]  (hidden comment: DIODE ZENER 16V 5W DO-214AA (SMB)_1)
Q1  MOSFET N-CH 200V 1.1A SSOT-6  [FAIR-SOT23-6_V]
Q2  MMBT3904  [FAIR-SOT23-3_V]
R1  Max Power Dissipation: 15W  [MP915-1.00K-1%-Footprint-1]  (hidden comment: RES 1K OHM 15W 1% TO126)
R2  Power (Watts): 1/10W  Resistance (Ohms): 1M  [RES, 0603]  (hidden comment: RES 1M OHM 1% 1/10W 0603)
R3  value 100k  [RESC2013X70X40ML20T20]  (hidden comment: Resistor 100k +/-1% 0805 125 mW)
R4  value 470k  Max Power Dissipation: 250mW  [RES 1206]  (hidden comment: RES SMD 470K OHM 0.1% 1/4W 1206)
R5  value 100k  [RESC2013X70X40ML20T20]  (hidden comment: Resistor 100k +/-1% 0805 125 mW)
R13  value 10k  [RESC2013X50X35ML15T15]  (hidden comment: Resistor 10k +/-1% 0805 125 mW)
R14  value 10k  [RESC2013X50X35ML15T15]  (hidden comment: Resistor 10k +/-1% 0805 125 mW)
R17  value 100k  [RESC2013X70X40ML20T20]  (hidden comment: Resistor 100k +/-1% 0805 125 mW)
TP7  Thru Test Point  [Thru Test Point]
TP8  Thru Test Point  [Thru Test Point]
TP9  Thru Test Point  [Thru Test Point]

### Ports
BULK_CAP_NEG (bidir), BULK_CAP_POS (bidir)

### Nets
BULK_CAP_NEG: C1.2 D2.1(A) Q1.4(S) Q2.2(E) R4.2 R14.1 ; port BULK_CAP_NEG
BULK_CAP_POS: D1.1(K) R1.2 R2.1 ; port BULK_CAP_POS
NetC1_1: C1.1 D2.2(K) R2.2 R3.2 TP7.TH_TP
NetD1_2: D1.2(A) R5.2
NetQ1_1: Q1.1(D) Q1.2(D) Q1.5(D) Q1.6(D) R1.1
NetQ1_3: Q1.3(G) Q2.3(C) R4.1 R17.1 TP8.TH_TP
NetQ2_1: Q2.1(B) R13.1 TP9.TH_TP
NetR3_1: R3.1 R17.2
NetR5_1: R5.1 R13.2 R14.2

### Notes on the sheet
- May have to tweak R2 (maybe 100k)
- Project:
- Title:
- Size:
- Project Author
- Letter
- Revision:
- University of Waterloo
- 200 University Ave W
- Waterloo, ON, Canada
- N2L 3E9
- Date:
- Sheet
- of
- Website:
- (in symbol CMP-013-00034-1) 1, 2, 5, 6

### Library data of the parts
C1 = CMP-013-0013-1: 1µF ±10% 50V Ceramic Capacitor X7R 0603 (1608 Metric); Manufacturer Part Number 1: UMK107AB7105KA-T; Manufacturer 1: Taiyo Yuden; ComponentLink1Description: http://www.yuden.co.jp/productdata/catalog/en/mlcc_all_e.pdf; Ratings: -; Part Status: Active; Packaging: Cut Tape (CT); Source: Schematic Diagrams.SchLib; Operating Temperature: -55°C ~ 125°C; Package / Case: 0603 (1608 Metric); Thickness (Max): 0.037" (0.95mm); Mounting Type: Surface Mount, MLCC; Height - Seated (Max): -; Design Item ID: CAP CER 1UF 50V 10% X7R 0603; Lead Spacing: -; Tolerance: 10%; Lead Style: -; ComponentLink1URL: http://www.yuden.co.jp/productdata/catalog/en/mlcc_all_e.pdf; Size / Dimension: 0.063" L x 0.031" W (1.60mm x 0.80mm)
D1 = CMP-004-00031-1: Diode Zener Single 68V 5% 500mW Automotive 2-Pin SOD-123 T/R; Impedance: 230R; Max Reverse Leakage Current: 100nA; Lead Free: Lead Free; Case/Package: SOD-123-2; Radiation Hardening: No; Number of Pins: 2; Zener Voltage: 68V; Element Configuration: Single; Packaging: Tape and Reel; Min Operating Temperature: -55°C; Tolerance: 5%; Max Operating Temperature: 150°C; Package Quantity: 3000; Voltage Tolerance: 5%; Max Power Dissipation: 500mW
D2 = CMP-014-0016-1: Zener Diode 16V 5W ±5% Surface Mount DO-214AA (SMB); Manufacture: Micro Commercial Co; Manufacture Part Number: SMBJ5353B-TP; Impedence (Max): 2.5 Ohm; Voltage - Forward: 1.2V @ 1A; Power (Max): 5W; Design Item ID: DIODE ZENER 16V 5W DO-214AA (SMB)_1; Source: Schematic Diagrams.SchLib
Q1 = CMP-013-00034-1: Trans MOSFET N-CH 200V 1.1A 6-Pin SuperSOT T/R; On-State Resistance: 725MR; Threshold Voltage: 4V; Turn-On Delay Time: 6ns; Power Dissipation: 1.6W; Gate to Source Voltage (Vgs): 20V; Input Capacitance: 234pF; Element Configuration: Single; Turn-Off Delay Time: 17ns; Number of Elements: 1; Max Power Dissipation: 800mW; REACH SVHC: No SVHC; Drain to Source Voltage (Vdss): 200V; Number of Pins: 6; Height: 1mm; Voltage Rating (DC): 200V; Packaging: Tape and Reel; Lead Free: Lead Free; Mount: Surface Mount; Weight: 0.036g; Drain to Source Resistance: 725mR; Max Operating Temperature: 150°C; Drain to Source Breakdown Voltage: 200V; Min Operating Temperature: -55°C; Length: 3mm; Case/Package: SOT-23-6; Continuous Drain Current (ID): 1.1A; Rise Time: 6ns; Width: 1.7mm; Rds On Max: 725mR; Package Quantity: 1; Current Rating: 1.1A; Contact Plating: Tin,Matte; Fall Time: 6ns
Q2 = CMP-014-00026-1: NPN General Purpose Amplifier, 40 V, 0.2 A, -55 to 150 degC, 3-Pin SOT23, RoHS, Tape and Reel; Manufacturer: Fairchild Semiconductor; Package Version: Rev. 12, 03/2016; Power: 625mW; Elements: 1; Vce Max: 300mV; hFE Min: 100; Frequency: 300MHz; Max Operating Temperature: 150°C; Packaging: TapeandReel; Case/Package: TO-236-3; Package URL: http://www.fairchildsemi.com/dwg/MA/MA03D.pdf; Datasheet Version: Rev. 1.1.0, 10/2014; Package Description: 3-Pin Small Outline Transistor, Body 2.92 x 1.325 mm, Pitch 0.95 mm; Package Quantity: 3000; Datasheet URL: https://www.fairchildsemi.com/datasheets/MM/MMBT3904.pdf; Manufacturer URL: https://www.fairchildsemi.com/; RoHS Compliant: True; Mounting Technology: SM; Min Operating Temperature: -55°C; Pins: 3; Package Reference: SOT23-3
R1 = CMP-009-00177-1: 1 kOhms ±1% 15W Through Hole Resistor TO-126-2 Moisture Resistant, Non-Inductive Thick Film; Lead Diameter: 0.64mm; Lead Length: 11.4mm; Voltage Rating: 200V; Temperature Coefficient: 80ppm/°C; Resistance: 1kR; Lead Free: Lead Free; Width: 0.11inch; Tolerance: 1%; Min Operating Temperature: -55°C; Voltage Rating (DC): 200V; Case/Package: TO-126; Composition: Thick Film; Thickness: 0.01inch; Features: Moisture Resistant; REACH SVHC: No SVHC; Max Operating Temperature: 150°C; Mount: Through Hole; Packaging: Rail/Tube; Length: 8.12mm; Height: 0.45inch; Number of Terminations: 2; Depth: 2.79mm; Lead Pitch: 5.08mm; Package Quantity: 50; Termination: Radial; Power Rating: 15W
R2 = CMP-010-0007-1: 1M Ohm ±1% 0.1W, 1/10W Chip Resistor 0603 (1608 Metric) Moisture Resistant Thick Film; Manufacturer 1: Yageo; Manufacturer Part Number 1: RC0603FR-071ML; Description 1: RES SMD 1M OHM 1% 1/10W 0603; Temperature Coefficient: ±100ppm/°C; Supplier Device Package: 0603; Stock 1: 2336711; RoHS: RoHS Compliant; Source: Schematic Diagrams.SchLib; Size / Dimension: 0.063" L x 0.031" W (1.60mm x 0.80mm); Failure Rate: -; ComponentLink1URL: http://www.yageo.com/documents/recent/PYu-RC_Group_51_RoHS_L_7.pdf; Features: Moisture Resistant; Height - Seated (Max): 0.022" (0.55mm); Packaging: Cut Tape (CT); Operating Temperature: -55°C ~ 155°C; ComponentLink1Description: http://www.yageo.com/documents/recent/PYu-RC_Group_51_RoHS_L_7.pdf; Tolerance: 1%; Composition: Thick Film; Part Status: Active; Pricing 1: 1=0.16, 10=0.022, 100=0.0089, 1000=0.00402, 2500=0.00349 (CAD); Design Item ID: RES 1M OHM 1% 1/10W 0603; Package / Case: 0603 (1608 Metric)
R3 R5 R17 = CMP-009-00024-4: Chip Resistor, 100 KOhm, +/- 1%, 0.125 W, -55 to 155 degC, 0805 (2012 Metric); Power: 125mW; Voltage Rating: 150V; Case/Package: 0805; Pins: 2; RoHS Compliant: True; Mounting Technology: SM; Tolerance: 1%; Max Operating Temperature: 155°C; Min Operating Temperature: -55°C
R4 = CMP-010-0046-1: 470 kOhms ±0.1% 0.25W, 1/4W Chip Resistor 1206 (3216 Metric) Anti-Sulfur, Automotive AEC-Q200 Thin Film; Manufacturer Part Number: RG3216P-4703-B-T1; Manufacturer: Susumu; Power Rating: 125mW; Temperature Coefficient: 25ppm/°C; Voltage Rating: 150V; Voltage Rating (DC): 200V; ComponentLink2Description: https://datasheet.ciiva.com/2490/rg-rm-rgh-datasheet-2490489.pdf; Stock 1: 2986; Tolerance: 0.1%; Case/Package: 1206; Packaging: Tape and Reel; Max Operating Temperature: 155°C; ComponentLink2URL: https://datasheet.ciiva.com/2490/rg-rm-rgh-datasheet-2490489.pdf; Termination: SMD/SMT; Package Quantity: 1; Number of Terminations: 2; Length: 0.126inch; ComponentLink3URL: https://datasheet.ciiva.com/2490/rg-rm-rgh-datasheet-2490490.pdf; Case Code (Metric): 3216; Width: 0.063inch; Lead Free: Lead Free; Design Item ID: RES SMD 470K OHM 0.1% 1/4W 1206; ComponentLink3Description: https://datasheet.ciiva.com/2490/rg-rm-rgh-datasheet-2490490.pdf; Source: Schematic Diagrams.SchLib; Min Operating Temperature: -55°C; Pins: 2; ComponentLink4URL: https://datasheet.ciiva.com/12760/rg-rm-rgh-datasheet-12760397.pdf; ComponentLink1Description: https://datasheet.ciiva.com/2490/rg-rm-rgh-datasheet-2490488.pdf; Height: 0.02inch; ComponentLink4Description: https://datasheet.ciiva.com/12760/rg-rm-rgh-datasheet-12760397.pdf; ComponentLink1URL: https://datasheet.ciiva.com/2490/rg-rm-rgh-datasheet-2490488.pdf; Composition: Thin Film; Pricing 1: 1=0.66, 10=0.474, 100=0.2462 (USD)
R13 R14 = CMP-009-00018-4: Chip Resistor, 10 KOhm, +/- 1%, 125 mW, -55 to 155 degC, 0805 (2012 Metric); Power: 125mW; Voltage Rating: 150V; RoHS Compliant: True; Mounting Technology: SM; Pins: 2; Case/Package: 0805; Min Operating Temperature: -55°C; Max Operating Temperature: 155°C; Tolerance: 1%
TP7-TP9 = CMP-003-0176-1: Design Item ID: Thru Test Point; Source: Schematic Diagrams.SchLib

## Nets that join several sheets
BULK_CAP_NEG: MSXIV_DC-DC_Converter (13 pins), MSXIV_Discharge_Circuit (6 pins)
BULK_CAP_POS: MSXIV_DC-DC_Converter (8 pins), MSXIV_Discharge_Circuit (D1.1 R1.2 R2.1)

## Assembly variants
Variant of MSXIV_DC-DC_Converter: not fitted C10 C19